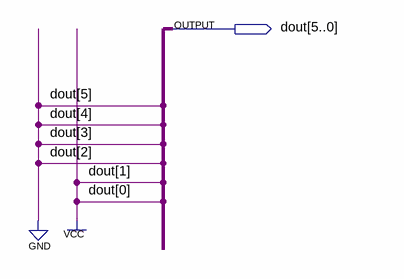
[diagram p0: schematic sheet]
// Quartus schematic Bus6bit3.bdf as structural Verilog: 0 symbols, 1 pins
module Bus6bit3 (
  output [5:0] dout
);


  assign dout = 6'b000011;
endmodule
